# EAGLE design pads (EAGLE 9.0.1)
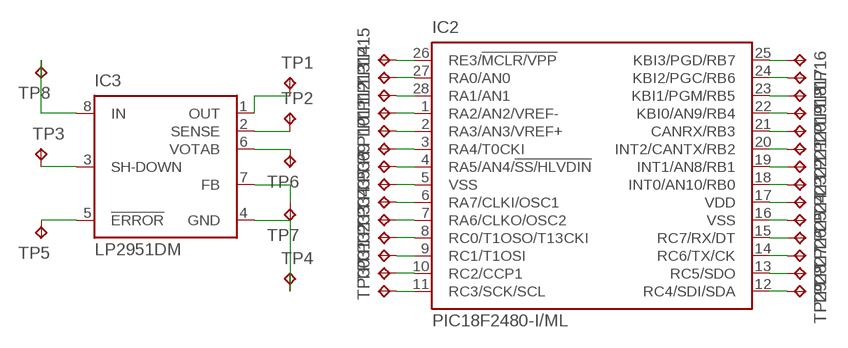
[diagram p0: schematic, sheet 1]

## Parts
IC2  PIC18F2480-I/ML  [QFN28-ML_6X6MM]
IC3  LP2951DM  [MICRO8]
TP1  TPPAD1-13Y  [P1-13Y]
TP2  TPPAD1-13Y  [P1-13Y]
TP3  TPPAD1-13Y  [P1-13Y]
TP4  TPPAD1-13Y  [P1-13Y]
TP5  TPPAD1-13Y  [P1-13Y]
TP6  TPPAD1-13Y  [P1-13Y]
TP7  TPPAD1-13Y  [P1-13Y]
TP8  TPPAD1-13Y  [P1-13Y]
TP9  TPPAD1-13Y  [P1-13Y]
TP10  TPPAD1-13Y  [P1-13Y]
TP11  TPPAD1-13Y  [P1-13Y]
TP12  TPPAD1-13Y  [P1-13Y]
TP13  TPPAD1-13Y  [P1-13Y]
TP14  TPPAD1-13Y  [P1-13Y]
TP15  TPPAD1-13Y  [P1-13Y]
TP16  TPPAD1-13Y  [P1-13Y]
TP17  TPPAD1-13Y  [P1-13Y]
TP18  TPPAD1-13Y  [P1-13Y]
TP19  TPPAD1-13Y  [P1-13Y]
TP20  TPPAD1-13Y  [P1-13Y]
TP21  TPPAD1-13Y  [P1-13Y]
TP22  TPPAD1-13Y  [P1-13Y]
TP23  TPPAD1-13Y  [P1-13Y]
TP24  TPPAD1-13Y  [P1-13Y]
TP25  TPPAD1-13Y  [P1-13Y]
TP26  TPPAD1-13Y  [P1-13Y]
TP27  TPPAD1-13Y  [P1-13Y]
TP28  TPPAD1-13Y  [P1-13Y]
TP29  TPPAD1-13Y  [P1-13Y]
TP30  TPPAD1-13Y  [P1-13Y]
TP31  TPPAD1-13Y  [P1-13Y]
TP32  TPPAD1-13Y  [P1-13Y]
TP33  TPPAD1-13Y  [P1-13Y]
TP34  TPPAD1-13Y  [P1-13Y]
TP35  TPPAD1-13Y  [P1-13Y]
TP36  TPPAD1-13Y  [P1-13Y]

## Nets
N$1: IC3.1(OUT) TP1.TP
N$2: IC3.2(SENSE) TP2.TP
N$3: IC3.6(VOTAB) TP6.TP
N$4: IC3.7(FB) TP7.TP
N$5: IC3.4(GND) TP4.TP
N$6: IC3.5(!ERROR) TP5.TP
N$7: IC3.3(SH-DOWN) TP3.TP
N$8: IC3.8(IN) TP8.TP
N$9: IC2.11(RC3/SCK/SCL) TP30.TP
N$10: IC2.10(RC2/CCP1) TP31.TP
N$11: IC2.9(RC1/T1OSI) TP32.TP
N$12: IC2.8(RC0/T1OSO/T13CKI) TP33.TP
N$13: IC2.7(RA6/CLKO/OSC2) TP34.TP
N$14: IC2.6(RA7/CLKI/OSC1) TP35.TP
N$15: IC2.5(VSS) TP36.TP
N$16: IC2.4(RA5/AN4/!SS/HLVDIN) TP9.TP
N$17: IC2.3(RA4/T0CKI) TP10.TP
N$18: IC2.2(RA3/AN3/VREF+) TP11.TP
N$19: IC2.1(RA2/AN2/VREF-) TP12.TP
N$20: IC2.28(RA1/AN1) TP13.TP
N$21: IC2.27(RA0/AN0) TP14.TP
N$22: IC2.26(RE3/!MCLR/VPP) TP15.TP
N$23: IC2.25(KBI3/PGD/RB7) TP16.TP
N$24: IC2.24(KBI2/PGC/RB6) TP17.TP
N$25: IC2.23(KBI1/PGM/RB5) TP18.TP
N$26: IC2.22(KBI0/AN9/RB4) TP19.TP
N$27: IC2.21(CANRX/RB3) TP20.TP
N$28: IC2.20(INT2/CANTX/RB2) TP21.TP
N$29: IC2.19(INT1/AN8/RB1) TP22.TP
N$30: IC2.18(INT0/AN10/RB0) TP23.TP
N$31: IC2.17(VDD) TP24.TP
N$32: IC2.16(VSS) TP25.TP
N$33: IC2.15(RC7/RX/DT) TP26.TP
N$34: IC2.14(RC6/TX/CK) TP27.TP
N$35: IC2.13(RC5/SDO) TP28.TP
N$36: IC2.12(RC4/SDI/SDA) TP29.TP

## Library data of the parts
IC2 = microchip:PIC18F2*80: 28-Pin Enhanced Flash Microcontrollers with ECAN(TM) Technology 10-Bit A/D and nanoWatt Technology Source: http://www.microchip.com .. 39637a.pdf; MF: MICROCHIP; MPN: PIC18F2480-I/ML; OC_FARNELL: 1556179; OC_NEWARK: 71J7235
IC3 = linear:LP2951: 100 mA, Low Power Low Dropout Voltage Regulator Source: http://www.onsemi.com/pub/Collateral/LP2950-D.PDF
TP1-TP36 = testpad:TP: Test pad

## Board
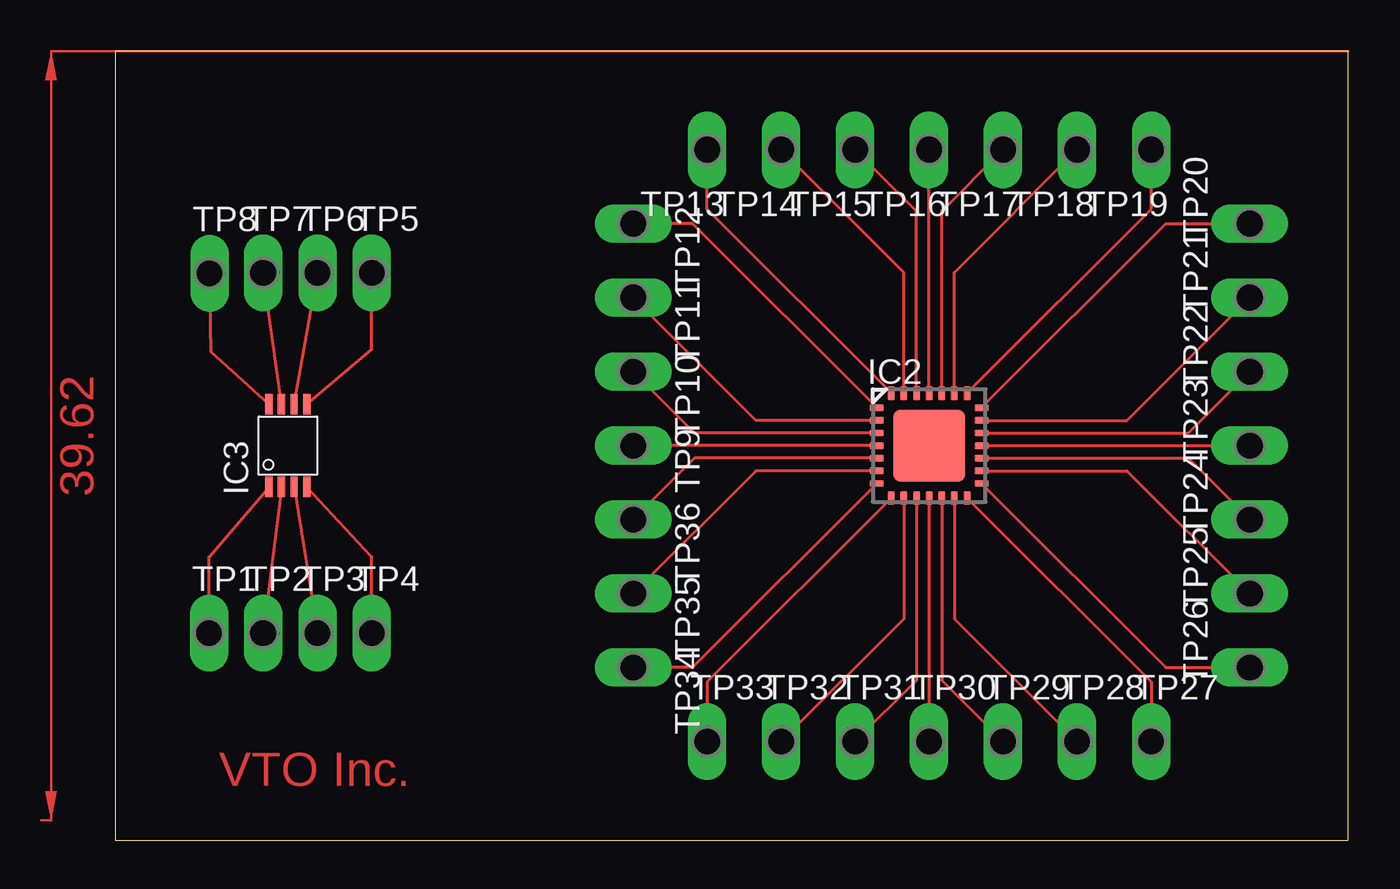
[diagram p1: board, top side]

Size 63.5 x 40.64 mm. Coordinates in mm from the lower left corner, seen from the top.
Outline: 0,0 63.5,0 63.5,40.64 0,40.64 0,0
Copper layers (1*16): Top 0.035mm / dielectric 1.5mm / Bottom 0.035mm
Design rules "default": minimum track width 6mil, minimum drill 0.35mm, track to track 6mil, track to pad 6mil, pad to pad 6mil, via to via 6mil, smd to smd 6mil, copper to edge 40mil, drill to drill 6mil, minimum pad ring 10mil, minimum via ring 8mil, stop-mask expansion 4mil, vias tented up to drill 0mil, thermal gap 10mil

### Footprints (pad centres in the part's own frame; a part is rotated, then mirrored left to right if it is on the bottom)
QFN28-ML_6X6MM = smd 0.7 x 0.35: 1 -2.7,1.95; 2 -2.7,1.3; 3 -2.7,0.65; 4 -2.7,0; 5 -2.7,-0.65; 6 -2.7,-1.3; 7 -2.7,-1.95; 15 2.7,-1.95; 16 2.7,-1.3; 17 2.7,-0.65; 18 2.7,0; 19 2.7,0.65; 20 2.7,1.3; 21 2.7,1.95 | smd 0.35 x 0.7: 8 -1.95,-2.7; 9 -1.3,-2.7; 10 -0.65,-2.7; 11 0,-2.7; 12 0.65,-2.7; 13 1.3,-2.7; 14 1.95,-2.7; 22 1.95,2.7; 23 1.3,2.7; 24 0.65,2.7; 25 0,2.7; 26 -0.65,2.7; 27 -1.3,2.7; 28 -1.95,2.7 | smd 3.7 x 3.7: EXP 0,0
MICRO8 = smd 0.38 x 1.05: 1 -0.975,-2.125; 2 -0.325,-2.125; 3 0.325,-2.125; 4 0.975,-2.125; 5 0.975,2.125; 6 0.325,2.125; 7 -0.325,2.125; 8 -0.975,2.125
P1-13Y = drill 1.321 pad 1.905 long: TP 0,0

### Placement (x,y rotation side)
IC2  41.91,20.32 0 top
IC3  8.89,20.32 0 top
TP1  4.83,10.67 0 top
TP2  7.62,10.67 0 top
TP3  10.41,10.67 0 top
TP4  13.21,10.67 0 top
TP5  13.21,29.21 0 top
TP6  10.41,29.21 0 top
TP7  7.62,29.21 0 top
TP8  4.86,29.19 0 top
TP9  26.67,20.32 270 top
TP10  26.67,24.13 270 top
TP11  26.67,27.94 270 top
TP12  26.67,31.75 270 top
TP13  30.48,35.56 180 top
TP14  34.29,35.56 180 top
TP15  38.1,35.56 180 top
TP16  41.91,35.56 180 top
TP17  45.72,35.56 180 top
TP18  49.53,35.56 180 top
TP19  53.34,35.56 180 top
TP20  58.42,31.75 90 top
TP21  58.42,27.94 90 top
TP22  58.42,24.13 90 top
TP23  58.42,20.32 90 top
TP24  58.42,16.51 90 top
TP25  58.42,12.7 90 top
TP26  58.42,8.89 90 top
TP27  53.34,5.08 0 top
TP28  49.53,5.08 0 top
TP29  45.72,5.08 0 top
TP30  41.91,5.08 0 top
TP31  38.1,5.08 0 top
TP32  34.29,5.08 0 top
TP33  30.48,5.08 0 top
TP34  26.67,8.89 270 top
TP35  26.67,12.7 270 top
TP36  26.67,16.51 270 top

### Tracks (layer width: path | path; a pad name or v marks a point on that pad's centre or on a via)
N$1
  Top 0.152: TP1.TP 4.83,14.6 IC3.1
N$2
  Top 0.152: IC3.2 TP2.TP
N$3
  Top 0.152: IC3.6 TP6.TP
N$4
  Top 0.152: IC3.7 TP7.TP
N$5
  Top 0.152: TP4.TP 13.21,14.6 IC3.4
N$6
  Top 0.152: IC3.5 13.21,25.28 TP5.TP
N$7
  Top 0.152: IC3.3 TP3.TP
N$8
  Top 0.152: IC3.8 4.95,25.15 TP8.TP
N$9
  Top 0.152: IC2.11 TP30.TP
N$10
  Top 0.152: IC2.10 41.26,8.24 TP31.TP
N$11
  Top 0.152: IC2.9 40.61,11.4 TP32.TP
N$12
  Top 0.152: IC2.8 30.48,8.14 TP33.TP
N$13
  Top 0.152: IC2.7 29.73,8.89 TP34.TP
N$14
  Top 0.152: IC2.6 32.99,19.02 TP35.TP
N$15
  Top 0.152: IC2.5 29.83,19.67 TP36.TP
N$16
  Top 0.152: IC2.4 TP9.TP
N$17
  Top 0.152: IC2.3 29.83,20.97 TP10.TP
N$18
  Top 0.152: IC2.2 32.99,21.62 TP11.TP
N$19
  Top 0.152: IC2.1 29.73,31.75 TP12.TP
N$20
  Top 0.152: IC2.28 30.48,32.5 TP13.TP
N$21
  Top 0.152: IC2.27 40.61,29.24 TP14.TP
N$22
  Top 0.152: IC2.26 41.26,32.4 TP15.TP
N$23
  Top 0.152: IC2.25 TP16.TP
N$24
  Top 0.152: IC2.24 42.56,32.4 TP17.TP
N$25
  Top 0.152: IC2.23 43.21,29.24 TP18.TP
N$26
  Top 0.152: IC2.22 53.34,32.5 TP19.TP
N$27
  Top 0.152: IC2.21 54.09,31.75 TP20.TP
N$28
  Top 0.152: IC2.20 52.1,21.62 TP21.TP
N$29
  Top 0.152: IC2.19 55.26,20.97 TP22.TP
N$30
  Top 0.152: IC2.18 TP23.TP
N$31
  Top 0.152: IC2.17 55.26,19.67 TP24.TP
N$32
  Top 0.152: IC2.16 52.1,19.02 TP25.TP
N$33
  Top 0.152: IC2.15 54.09,8.89 TP26.TP
N$34
  Top 0.152: IC2.14 53.34,8.14 TP27.TP
N$35
  Top 0.152: IC2.13 43.21,11.4 TP28.TP
N$36
  Top 0.152: IC2.12 42.56,8.24 TP29.TP
(copper drawn outside any net)
  shapes: Top area x2

### Text on the board
Top: VTO Inc.